# Altium schematic sheet Switches.SchDoc: Mechanical Switches
size A; Author: Parth Thakkar; Organization: Low Self Esteam; Revision: v1.0; SheetNumber: 6; SheetTotal: 8
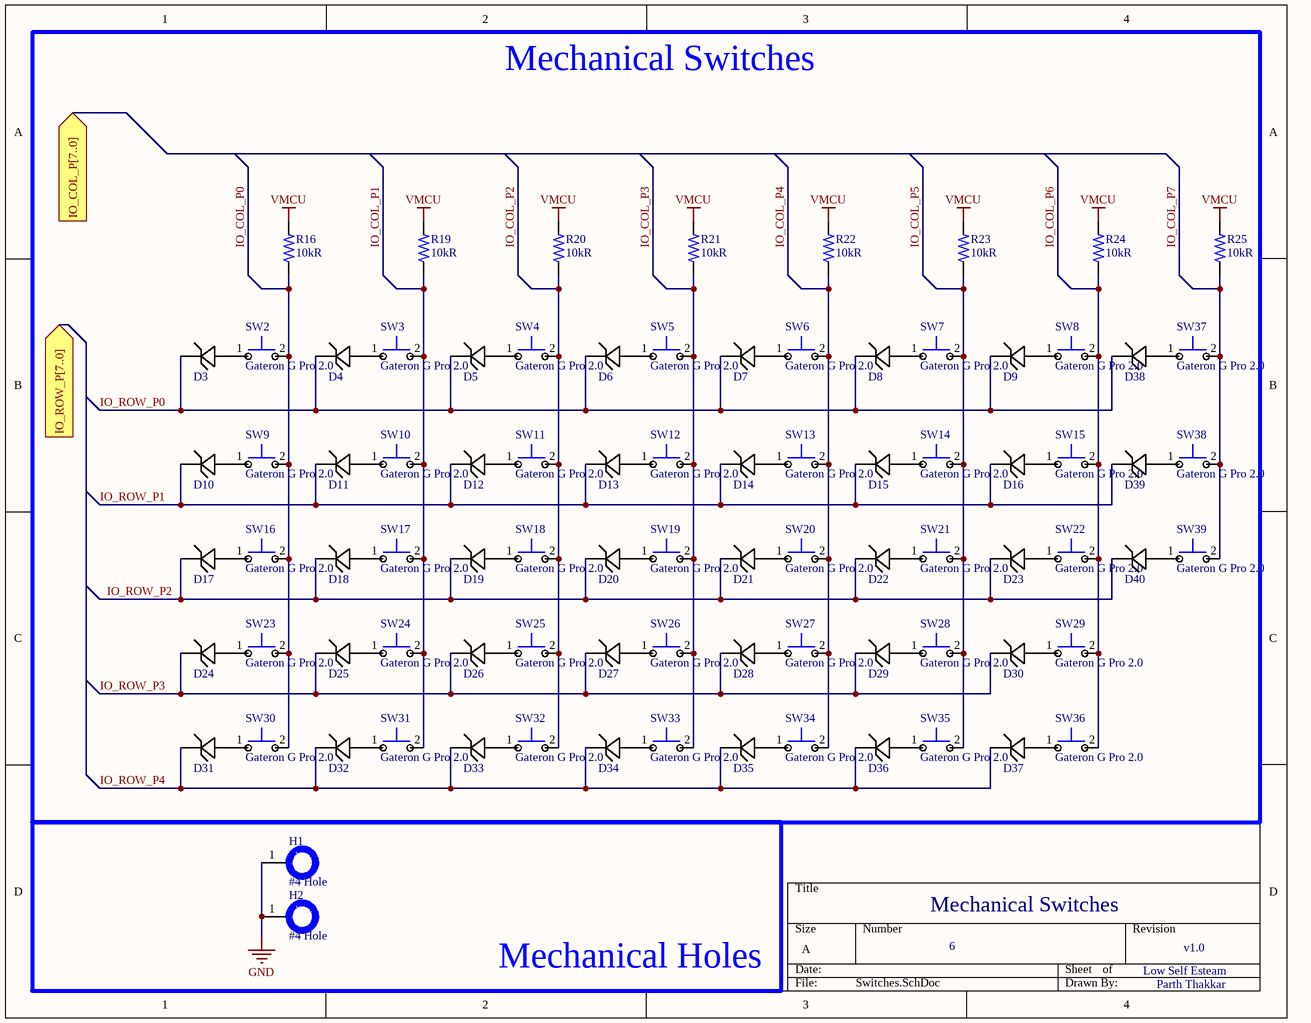
[diagram p0: Switches.SchDoc]

## Parts
D3  Diode Schottky  [Diode Schottky]  (value not drawn)
D4  Diode Schottky  [Diode Schottky]  (value not drawn)
D5  Diode Schottky  [Diode Schottky]  (value not drawn)
D6  Diode Schottky  [Diode Schottky]  (value not drawn)
D7  Diode Schottky  [Diode Schottky]  (value not drawn)
D8  Diode Schottky  [Diode Schottky]  (value not drawn)
D9  Diode Schottky  [Diode Schottky]  (value not drawn)
D10  Diode Schottky  [Diode Schottky]  (value not drawn)
D11  Diode Schottky  [Diode Schottky]  (value not drawn)
D12  Diode Schottky  [Diode Schottky]  (value not drawn)
D13  Diode Schottky  [Diode Schottky]  (value not drawn)
D14  Diode Schottky  [Diode Schottky]  (value not drawn)
D15  Diode Schottky  [Diode Schottky]  (value not drawn)
D16  Diode Schottky  [Diode Schottky]  (value not drawn)
D17  Diode Schottky  [Diode Schottky]  (value not drawn)
D18  Diode Schottky  [Diode Schottky]  (value not drawn)
D19  Diode Schottky  [Diode Schottky]  (value not drawn)
D20  Diode Schottky  [Diode Schottky]  (value not drawn)
D21  Diode Schottky  [Diode Schottky]  (value not drawn)
D22  Diode Schottky  [Diode Schottky]  (value not drawn)
D23  Diode Schottky  [Diode Schottky]  (value not drawn)
D24  Diode Schottky  [Diode Schottky]  (value not drawn)
D25  Diode Schottky  [Diode Schottky]  (value not drawn)
D26  Diode Schottky  [Diode Schottky]  (value not drawn)
D27  Diode Schottky  [Diode Schottky]  (value not drawn)
D28  Diode Schottky  [Diode Schottky]  (value not drawn)
D29  Diode Schottky  [Diode Schottky]  (value not drawn)
D30  Diode Schottky  [Diode Schottky]  (value not drawn)
D31  Diode Schottky  [Diode Schottky]  (value not drawn)
D32  Diode Schottky  [Diode Schottky]  (value not drawn)
D33  Diode Schottky  [Diode Schottky]  (value not drawn)
D34  Diode Schottky  [Diode Schottky]  (value not drawn)
D35  Diode Schottky  [Diode Schottky]  (value not drawn)
D36  Diode Schottky  [Diode Schottky]  (value not drawn)
D37  Diode Schottky  [Diode Schottky]  (value not drawn)
D38  Diode Schottky  [Diode Schottky]  (value not drawn)
D39  Diode Schottky  [Diode Schottky]  (value not drawn)
D40  Diode Schottky  [Diode Schottky]  (value not drawn)
H1  #4 Hole  [Hole]  (no BOM)
H2  #4 Hole  [Hole]  (no BOM)
R16  value 10kR  [Resistor 0603]  (hidden comment: RES 10K 0603)
R19  value 10kR  [Resistor 0603]  (hidden comment: RES 10K 0603)
R20  value 10kR  [Resistor 0603]  (hidden comment: RES 10K 0603)
R21  value 10kR  [Resistor 0603]  (hidden comment: RES 10K 0603)
R22  value 10kR  [Resistor 0603]  (hidden comment: RES 10K 0603)
R23  value 10kR  [Resistor 0603]  (hidden comment: RES 10K 0603)
R24  value 10kR  [Resistor 0603]  (hidden comment: RES 10K 0603)
R25  value 10kR  [Resistor 0603]  (hidden comment: RES 10K 0603)
SW2  Gateron G Pro 2.0  [Mechanical Switch]
SW3  Gateron G Pro 2.0  [Mechanical Switch]
SW4  Gateron G Pro 2.0  [Mechanical Switch]
SW5  Gateron G Pro 2.0  [Mechanical Switch]
SW6  Gateron G Pro 2.0  [Mechanical Switch]
SW7  Gateron G Pro 2.0  [Mechanical Switch]
SW8  Gateron G Pro 2.0  [Mechanical Switch]
SW9  Gateron G Pro 2.0  [Mechanical Switch]
SW10  Gateron G Pro 2.0  [Mechanical Switch]
SW11  Gateron G Pro 2.0  [Mechanical Switch]
SW12  Gateron G Pro 2.0  [Mechanical Switch]
SW13  Gateron G Pro 2.0  [Mechanical Switch]
SW14  Gateron G Pro 2.0  [Mechanical Switch]
SW15  Gateron G Pro 2.0  [Mechanical Switch]
SW16  Gateron G Pro 2.0  [Mechanical Switch]
SW17  Gateron G Pro 2.0  [Mechanical Switch]
SW18  Gateron G Pro 2.0  [Mechanical Switch]
SW19  Gateron G Pro 2.0  [Mechanical Switch]
SW20  Gateron G Pro 2.0  [Mechanical Switch]
SW21  Gateron G Pro 2.0  [Mechanical Switch]
SW22  Gateron G Pro 2.0  [Mechanical Switch]
SW23  Gateron G Pro 2.0  [Mechanical Switch]
SW24  Gateron G Pro 2.0  [Mechanical Switch]
SW25  Gateron G Pro 2.0  [Mechanical Switch]
SW26  Gateron G Pro 2.0  [Mechanical Switch]
SW27  Gateron G Pro 2.0  [Mechanical Switch]
SW28  Gateron G Pro 2.0  [Mechanical Switch]
SW29  Gateron G Pro 2.0  [Mechanical Switch]
SW30  Gateron G Pro 2.0  [Mechanical Switch]
SW31  Gateron G Pro 2.0  [Mechanical Switch]
SW32  Gateron G Pro 2.0  [Mechanical Switch]
SW33  Gateron G Pro 2.0  [Mechanical Switch]
SW34  Gateron G Pro 2.0  [Mechanical Switch]
SW35  Gateron G Pro 2.0  [Mechanical Switch]
SW36  Gateron G Pro 2.0  [Mechanical Switch]
SW37  Gateron G Pro 2.0  [Mechanical Switch]
SW38  Gateron G Pro 2.0  [Mechanical Switch]
SW39  Gateron G Pro 2.0  [Mechanical Switch]

## Blocks framed on the sheet
Mechanical Switches: D3-D40 R16 R19-R25 SW2-SW39
Mechanical Holes: H1 H2

## Ports
IO_COL_P[7..0] (in, see 1[4B], 4[1A]), IO_ROW_P[7..0] (in, see 1[4B], 4[1A])

## Nets
GND: H1.1 H2.1
VMCU: R16.2 R19.2 R20.2 R21.2 R22.2 R23.2 R24.2 R25.2
IO_COL_P0: R16.1 SW2.2 SW9.2 SW16.2 SW23.2 SW30.2
IO_COL_P1: R19.1 SW3.2 SW10.2 SW17.2 SW24.2 SW31.2
IO_COL_P2: R20.1 SW4.2 SW11.2 SW18.2 SW25.2 SW32.2
IO_COL_P3: R21.1 SW5.2 SW12.2 SW19.2 SW26.2 SW33.2
IO_COL_P4: R22.1 SW6.2 SW13.2 SW20.2 SW27.2 SW34.2
IO_COL_P5: R23.1 SW7.2 SW14.2 SW21.2 SW28.2 SW35.2
IO_COL_P6: R24.1 SW8.2 SW15.2 SW22.2 SW29.2 SW36.2
IO_COL_P7: R25.1 SW37.2 SW38.2 SW39.2
IO_ROW_P0: D3.3 D4.3 D5.3 D6.3 D7.3 D8.3 D9.3 D38.3
IO_ROW_P1: D10.3 D11.3 D12.3 D13.3 D14.3 D15.3 D16.3 D39.3
IO_ROW_P2: D17.3 D18.3 D19.3 D20.3 D21.3 D22.3 D23.3 D40.3
IO_ROW_P3: D24.3 D25.3 D26.3 D27.3 D28.3 D29.3 D30.3
IO_ROW_P4: D31.3 D32.3 D33.3 D34.3 D35.3 D36.3 D37.3
NetD3_1: D3.1 SW2.1
NetD4_1: D4.1 SW3.1
NetD5_1: D5.1 SW4.1
NetD6_1: D6.1 SW5.1
NetD7_1: D7.1 SW6.1
NetD8_1: D8.1 SW7.1
NetD9_1: D9.1 SW8.1
NetD10_1: D10.1 SW9.1
NetD11_1: D11.1 SW10.1
NetD12_1: D12.1 SW11.1
NetD13_1: D13.1 SW12.1
NetD14_1: D14.1 SW13.1
NetD15_1: D15.1 SW14.1
NetD16_1: D16.1 SW15.1
NetD17_1: D17.1 SW16.1
NetD18_1: D18.1 SW17.1
NetD19_1: D19.1 SW18.1
NetD20_1: D20.1 SW19.1
NetD21_1: D21.1 SW20.1
NetD22_1: D22.1 SW21.1
NetD23_1: D23.1 SW22.1
NetD24_1: D24.1 SW23.1
NetD25_1: D25.1 SW24.1
NetD26_1: D26.1 SW25.1
NetD27_1: D27.1 SW26.1
NetD28_1: D28.1 SW27.1
NetD29_1: D29.1 SW28.1
NetD30_1: D30.1 SW29.1
NetD31_1: D31.1 SW30.1
NetD32_1: D32.1 SW31.1
NetD33_1: D33.1 SW32.1
NetD34_1: D34.1 SW33.1
NetD35_1: D35.1 SW34.1
NetD36_1: D36.1 SW35.1
NetD37_1: D37.1 SW36.1
NetD38_1: D38.1 SW37.1
NetD39_1: D39.1 SW38.1
NetD40_1: D40.1 SW39.1

## Library data of the parts
D3-D40 = Diode Schottky: Rectifier Diode, Schottky, 2 Element, 0.2A, 30V V(RRM), Silicon; Manufacturer: Good-Ark; Manufacturer Part Number: BAT54C; Package Body Material: Plastic; Number of Elements: 2; Max Output current: 200mA; Max Power Dissipation: 290mW; Reverse Recovery Time-Max: 0.005us; Supplier: Digikey; Supplier Part Number: 4786-BAT54CCT-ND; RoHS: Yes; Category: Diodes; Stock: 18297; Pricing: 1=0.1, 10=0.052, 100=0.0348, 500=0.0263, 1000=0.02338 (USD); Pins: 3; Max Operating Temperature: 150°C; ComponentLink1URL: https://datasheet.ciiva.com:443/pdfs/VipMasterIC/IC/GOAE/GOAE-S-A0004282608/GOAE-S-A0004282608-1.pdf?src-supplier=IHS+Markit; ComponentLink1Description: https://datasheet.ciiva.com:443/pdfs/VipMasterIC/IC/GOAE/GOAE-S-A0004282608/GOAE-S-A0004282608-1.pdf?src-supplier=IHS+Markit; Diode Element Material: SILICON; Package Shape: Rectangular; Diode Type: RECTIFIER; JESD-30 Code: R-PDSO-G3; Package Style: SMALL OUTLINEMeter; Rep Pk Reverse Voltage-Max: 30V; Surface Mount: Yes; Technology: SCHOTTKY; Terminal Form: Gull Wing; Terminal Position: DUAL; Reach SVHC Compliant: Yes; RoHS Compliant: Yes
H1 H2 = HOLE_#4
R16 R19-R25 = RES 10K 0603: Fixed Resistor, Metal Glaze/thick Film, 0.1W, 10000ohm, 75V, 1% +/-Tol, 100ppm/Cel, Surface Mount, 0603; Manufacturer: Yageo; Manufacturer Part Number: RC0603FR-0710KL; Additional Feature: LASER TRIMMABLE; Power: 100mW; Rated Temperature: 70°C; Temperature Coefficient: 100ppm/°C; Package Height: 0.45mm; Package Length: 1.6mm; Package Width: 0.8mm; Supplier: Digikey; Supplier Part Number: 311-10.0KHRCT-ND; RoHS: Yes; Category: Chip SMD Resistors; Stock: 6878448; Pricing: 1=0.1, 10=0.019, 50=0.0112, 100=0.0093, 500=0.00622, 1000=0.00532, 5000=0.00382, 10000=0.00335, 25000=0.00287, 35000=0.00278, 50000=0.00257, 125000=0.00232 (USD); Mounting Technology: Surface Mount; Pins: 2; Package Shape: Rectangular; Case/Package: 0603; Terminal Finish: Nickel; Min Operating Temperature: -55°C; Max Operating Temperature: 155°C; Tolerance: 1%; JESD-609 Code: e3; Resistor Type: FIXED RESISTOR; Construction: Chip; Package Style: SMTMeter; Packaging: Tape and Reel; Technology: METAL GLAZE/THICK FILM; Termination: Wraparound; Working Voltage: 75V; Reach SVHC Compliant: Yes; RoHS Compliant: Yes; ComponentLink1URL: https://datasheet.ciiva.com:443/pdfs/VipMasterIC/IC/YAGO/YAGO-S-A0008145938/YAGO-S-A0008145938-1.pdf?src-supplier=IHS+Markit; ComponentLink1Description: https://datasheet.ciiva.com:443/pdfs/VipMasterIC/IC/YAGO/YAGO-S-A0008145938/YAGO-S-A0008145938-1.pdf?src-supplier=IHS+Markit; ComponentLink2URL: http://www.farnell.com/datasheets/2167052.pdf?src-supplier=Farnell; ComponentLink2Description: http://www.farnell.com/datasheets/2167052.pdf?src-supplier=Farnell; ComponentLink3URL: http://www.farnell.com/datasheets/1868787.pdf?src-supplier=Farnell; ComponentLink3Description: http://www.farnell.com/datasheets/1868787.pdf?src-supplier=Farnell; ComponentLink4URL: http://www.farnell.com/datasheets/443971.pdf?src-supplier=Farnell; ComponentLink4Description: http://www.farnell.com/datasheets/443971.pdf?src-supplier=Farnell; ComponentLink5URL: http://www.yageo.com/documents/recent/PYu-RC_Group_51_RoHS_L_10.pdf?src-supplier=Digikey; ComponentLink5Description: http://www.yageo.com/documents/recent/PYu-RC_Group_51_RoHS_L_10.pdf?src-supplier=Digikey; ComponentLink6URL: http://www.yageo.com/documents/recent/PYu-RC_Group_51_RoHS_L_9.pdf?src-supplier=Component+Sense; ComponentLink6Description: http://www.yageo.com/documents/recent/PYu-RC_Group_51_RoHS_L_9.pdf?src-supplier=Component+Sense
SW2-SW39 = Gateron G Pro 2.0: Gateron G Pro 2.0, The 3-Pin switches are compatible with any 3-Pin/5-Pin MX mechanical keyboard